# EAGLE design PCB-TBAR-BOR (EAGLE 6.5.0)
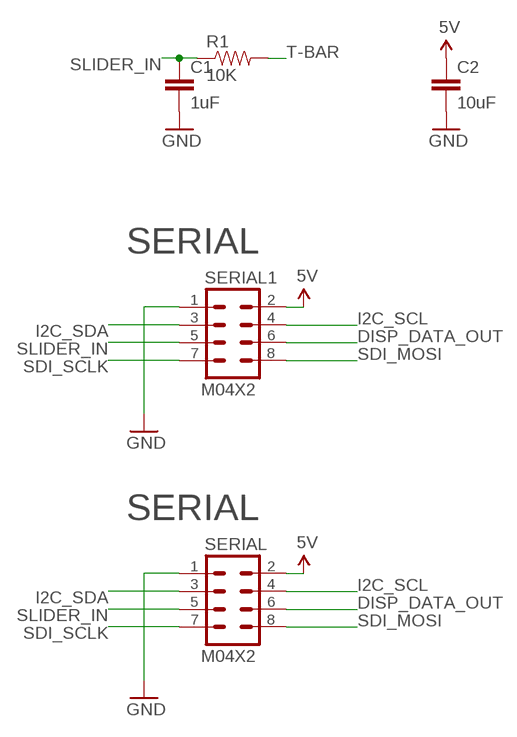
[diagram p0: schematic, sheet 1]

## Parts
C1  1uF  CAP0603-CAP  [0603-CAP]
C2  10uF  CAP0805  [0805]
R1  10K  RESISTOR0603-RES  [0603-RES]
SERIAL  M04X2  [2X4]
SERIAL1  M04X2  [2X4]

## Nets
5V [Power]: C2.1 SERIAL1.2 SERIAL.2
DISP_DATA_OUT: SERIAL1.6 SERIAL.6
GND [Power]: C1.2 C2.2 SERIAL1.1 SERIAL.1
I2C_SCL: SERIAL1.4 SERIAL.4
I2C_SDA: SERIAL1.3 SERIAL.3
SDI_MOSI: SERIAL1.8 SERIAL.8
SDI_SCLK: SERIAL1.7 SERIAL.7
SLIDER_IN: C1.1 R1.1 SERIAL1.5 SERIAL.5
T-BAR: R1.2

## Notes on the sheet
- SERIAL
- SERIAL

## Library data of the parts
C1 C2 = SparkFun:CAP: Capacitor Standard 0603 ceramic capacitor, and 0.1" leaded capacitor.
R1 = SparkFun:RESISTOR: Resistor Basic schematic elements and footprints for 0603, 1206, and PTH resistors.
SERIAL SERIAL1 = SparkFun:M04X2

## Net classes
0 default: width 0.203 mm, drill 0.406 mm, clearance 0.203 mm
1 Power: width 0.406 mm, drill 0.61 mm, clearance 0.203 mm

## Board
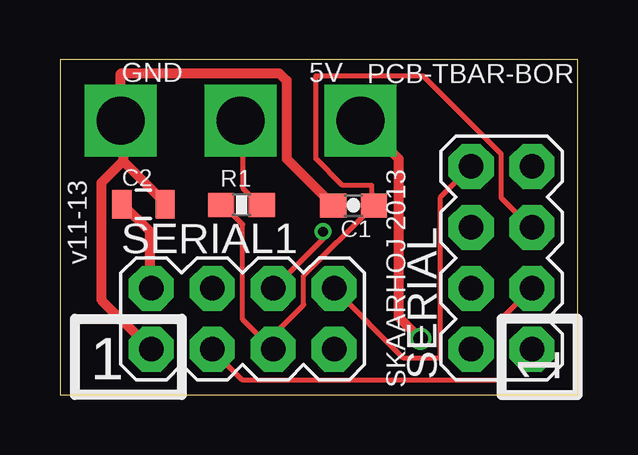
[diagram p1: board, top side]
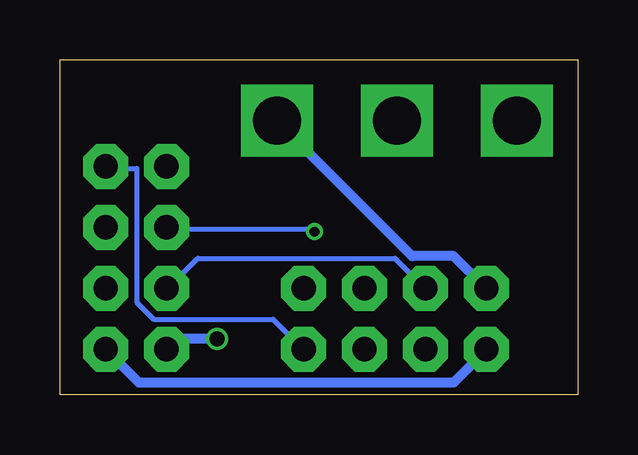
[diagram p2: board, bottom side, seen from below]

Size 21.59 x 13.97 mm. Coordinates in mm from the lower left corner, seen from the top.
Outline: 0,0 21.59,0 21.59,13.97 0,13.97 0,0
Copper layers (1*16): Top 0.035mm / dielectric 1.5mm / Bottom 0.035mm
Design rules "default": minimum track width 6mil, minimum drill 12mil, track to track 6mil, track to pad 6mil, pad to pad 6mil, via to via 6mil, smd to smd 0mil, copper to edge 10mil, drill to drill 10mil, minimum pad ring 10mil, minimum via ring 6mil, stop-mask expansion 2mil, vias tented up to drill 100mil, thermal gap 10mil

### Footprints (pad centres in the part's own frame; a part is rotated, then mirrored left to right if it is on the bottom)
0603-CAP = smd 1.1 x 1: 1 -0.85,0; 2 0.85,0
0805 = smd 0.8 x 1.2: 1 -0.9,0; 2 0.9,0
0603-RES = smd 1.1 x 1: 1 -0.85,0; 2 0.85,0
2X4 = drill 1.016 pad 1.88 octagon: 1 -3.81,-1.27; 2 -3.81,1.27; 3 -1.27,-1.27; 4 -1.27,1.27; 5 1.27,-1.27; 6 1.27,1.27; 7 3.81,-1.27; 8 3.81,1.27

### Placement (x,y rotation side)
C1  12.24,7.9 180 top
C2  3.48,7.95 0 top
R1  7.57,7.92 0 top
SERIAL  18.41,5.71 90 top
SERIAL1  7.62,3.17 0 top

### Tracks (layer width: path | path; a pad name or v marks a point on that pad's centre or on a via)
5V  (via drill 0.61, 2)
  Top 0.406: C2.1 2.64,7.92 3.76,6.81 3.76,4.47 SERIAL1.2 | v15.04,2.34 14.12,3.25 14.12,9.86 12.6,11.38 v12.54,11.43
  Bottom 0.406: 17.07,1.93 SERIAL.2 16.87,1.93 16.46,2.34 v15.04,2.34 | v12.54,11.43 12.5,11.38 6.91,5.79 5.18,5.79 3.86,4.47 SERIAL1.2
DISP_DATA_OUT  (via drill 0.41)
  Top 0.203: 17.07,6.3 17.07,6.91 SERIAL.6 | v10.97,6.81 10.97,6.5 8.94,4.47 SERIAL1.6
  Bottom 0.203: v10.97,6.81 11.07,6.91 17.07,6.91 SERIAL.6
GND  (via drill 2)
  Top 0.406: C1.2 11.38,7.92 9.45,9.86 9.45,13.11 9.14,13.41 2.54,13.41 v2.54,11.43 2.64,11.28 2.64,9.75 | 2.64,9.75 4.37,8.03 C2.2 | 2.64,9.75 1.73,8.84 1.73,3.96 3.76,1.93 SERIAL1.1
  Bottom 0.406: SERIAL.1 18.29,0.51 5.18,0.51 3.86,1.83 SERIAL1.1
I2C_SCL
  Bottom 0.203: SERIAL1.4 6.4,4.47 7.62,5.69 15.85,5.69 17.07,4.47 SERIAL.4
I2C_SDA
  Top 0.203: SERIAL.3 18.39,3.15 18.39,0.61 7.62,0.61 6.4,1.83 SERIAL1.3
SDI_MOSI
  Top 0.203: SERIAL.8 15.85,8.23 15.85,1.52 14.33,1.52 11.48,4.37 SERIAL1.8
SDI_SCLK
  Bottom 0.203: SERIAL1.7 11.48,1.93 12.7,3.15 17.68,3.15 18.39,3.86 18.39,9.45 19.61,9.45 SERIAL.7
SLIDER_IN
  Top 0.203: R1.1 6.81,7.92 7.62,7.11 7.62,3.15 8.84,1.93 SERIAL1.5 8.64,2.23 10.16,3.76 10.16,4.98 13.01,7.82 C1.1 13.01,7.92 13.01,8.74 11.79,8.74 10.67,9.86 10.67,13.31 15.14,13.31 18.39,10.06 18.39,8.23 19.61,7.01 SERIAL.5
T-BAR  (via drill 2)
  Top 0.203: R1.2 8.33,7.92 7.62,8.64 7.62,11.38 v7.54,11.43

### Text on the board
_tsilk: PCB-TBAR-BOR | GND | 5V | v11-13 | 1 | 1 | SKAARHOJ 2013